# EAGLE design sumo_motor_5 (EAGLE 6.3)
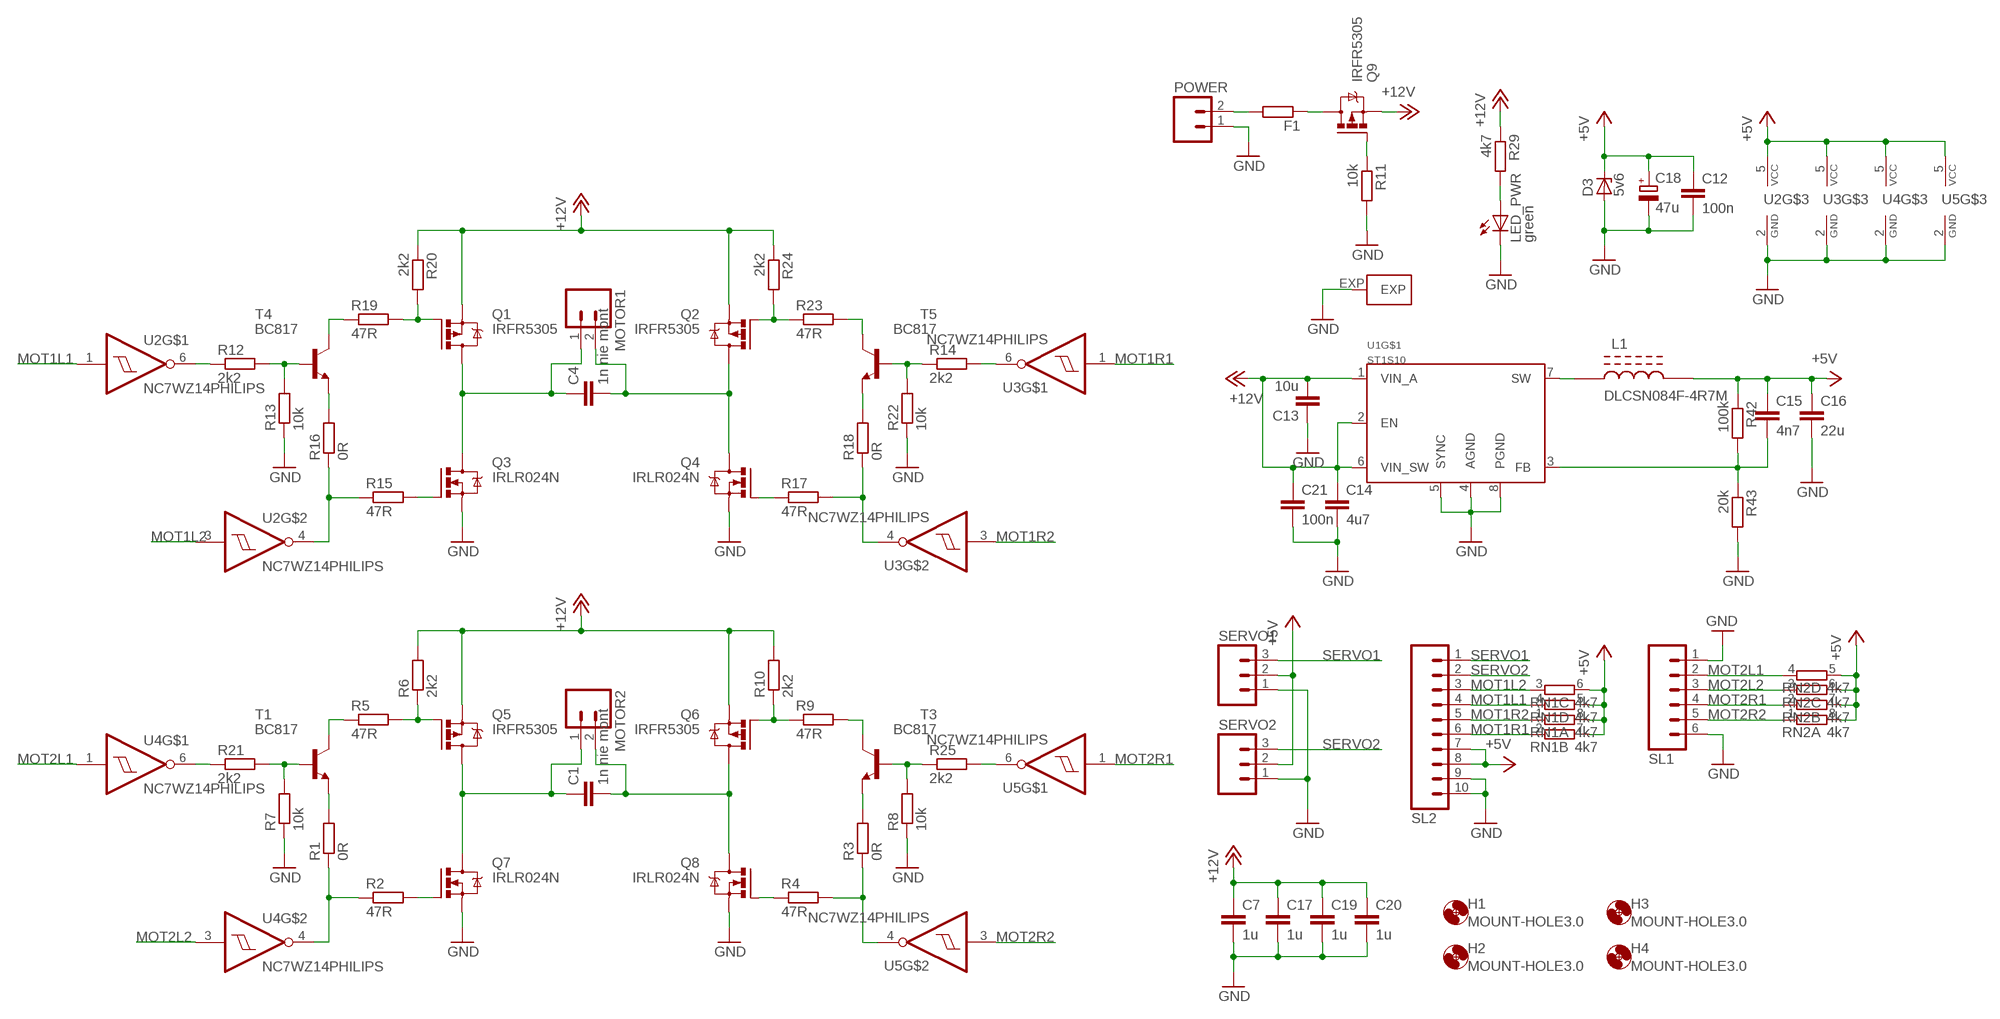
[diagram p0: schematic, sheet 1]

## Parts
C1  1n nie mont  C-EU025-025X050  [C025-025X050]
C4  1n nie mont  C-EU025-025X050  [C025-025X050]
C7  1u  C-EUC0805  [C0805]
C12  100n  C-EUC0805  [C0805]
C13  10u  C-EUC1206K  [C1206K]
C14  4u7  C-EUC0805  [C0805]
C15  4n7  C-EUC0805  [C0805]
C16  22u  C-EUC0805  [C0805]
C17  1u  C-EUC0805  [C0805]
C18  47u  CPOL-EUSMCB  [SMC_B]
C19  1u  C-EUC0805  [C0805]
C20  1u  C-EUC0805  [C0805]
C21  100n  C-EUC0805  [C0805]
D3  5v6  ZENER-DIODESMB  [SMB]
F1  R-EU_VMTA55  [VMTA55]
H1  MOUNT-HOLE3.0  [3,0]
H2  MOUNT-HOLE3.0  [3,0]
H3  MOUNT-HOLE3.0  [3,0]
H4  MOUNT-HOLE3.0  [3,0]
L1  DLCSN084F-4R7M  DLCSN084F  [CSN084F]
LED_PWR  green  LEDSML0805  [SML0805]
MOTOR1  M02  [02P]
MOTOR2  M02  [02P]
POWER  M02  [02P]
Q1  IRFR5305  [D-PAK_TO252AA]
Q2  IRFR5305  [D-PAK_TO252AA]
Q3  IRLR024N  [D-PAK_TO252AA]
Q4  IRLR024N  [D-PAK_TO252AA]
Q5  IRFR5305  [D-PAK_TO252AA]
Q6  IRFR5305  [D-PAK_TO252AA]
Q7  IRLR024N  [D-PAK_TO252AA]
Q8  IRLR024N  [D-PAK_TO252AA]
Q9  IRFR5305  [D-PAK_TO252AA]
R1  0R  R-EU_R0603  [R0603]
R2  47R  R-EU_R0603  [R0603]
R3  0R  R-EU_R0603  [R0603]
R4  47R  R-EU_R0603  [R0603]
R5  47R  R-EU_R0603  [R0603]
R6  2k2  R-EU_R0603  [R0603]
R7  10k  R-EU_R0603  [R0603]
R8  10k  R-EU_R0603  [R0603]
R9  47R  R-EU_R0603  [R0603]
R10  2k2  R-EU_R0603  [R0603]
R11  10k  R-EU_R0603  [R0603]
R12  2k2  R-EU_R0603  [R0603]
R13  10k  R-EU_R0603  [R0603]
R14  2k2  R-EU_R0603  [R0603]
R15  47R  R-EU_R0603  [R0603]
R16  0R  R-EU_R0603  [R0603]
R17  47R  R-EU_R0603  [R0603]
R18  0R  R-EU_R0603  [R0603]
R19  47R  R-EU_R0603  [R0603]
R20  2k2  R-EU_R0603  [R0603]
R21  2k2  R-EU_R0603  [R0603]
R22  10k  R-EU_R0603  [R0603]
R23  47R  R-EU_R0603  [R0603]
R24  2k2  R-EU_R0603  [R0603]
R25  2k2  R-EU_R0603  [R0603]
R29  4k7  R-EU_R0603  [R0603]
R42  100k  R-EU_R0603  [R0603]
R43  20k  R-EU_R0603  [R0603]
RN1  4k7  CAT16XXXJ4CAT16  [CAT16XXX]
RN2  4k7  CAT16XXXJ4CAT16  [CAT16XXX]
SERVO1  M03  [03P]
SERVO2  M03  [03P]
SL1  M06  [06P]
SL2  M10  [10P]
T1  BC817  BC817-16-NPN-SOT23-BEC  [SOT23-BEC]
T3  BC817  BC817-16-NPN-SOT23-BEC  [SOT23-BEC]
T4  BC817  BC817-16-NPN-SOT23-BEC  [SOT23-BEC]
T5  BC817  BC817-16-NPN-SOT23-BEC  [SOT23-BEC]
U1  ST1S10  [HSOP8]
U2  NC7WZ14PHILIPS  [SOT363_PHILIPS]
U3  NC7WZ14PHILIPS  [SOT363_PHILIPS]
U4  NC7WZ14PHILIPS  [SOT363_PHILIPS]
U5  NC7WZ14PHILIPS  [SOT363_PHILIPS]

## Nets
+5V: C12.1 C15.1 C16.1 C18.+ D3.C L1.2 R42.1 RN1.5 RN1.6 RN1.7 RN1.8 RN2.5 RN2.6 RN2.7 RN2.8 SERVO1.2 SERVO2.2 SL2.7 SL2.8 U2.5(VCC) U3.5(VCC) U4.5(VCC) U5.5(VCC)
+12V: C7.1 C13.2 C14.1 C17.1 C19.1 C20.1 C21.1 Q1.3(S) Q2.3(S) Q5.3(S) Q6.3(S) Q9.3(S) R6.2 R10.2 R20.1 R24.1 R29.1 U1.1(VIN_A) U1.2(EN) U1.6(VIN_SW)
GND: C7.2 C12.2 C13.1 C14.2 C16.2 C17.2 C18.- C19.2 C20.2 C21.2 D3.A LED_PWR.C POWER.1 Q3.3(S) Q4.3(S) Q7.3(S) Q8.3(S) R7.1 R8.1 R11.2 R13.1 R22.1 R43.2 SERVO1.1 SERVO2.1 SL1.1 SL1.6 SL2.9 SL2.10 U1.4(AGND) U1.5(SYNC) U1.8(PGND) U1.EXP U2.2(GND) U3.2(GND) U4.2(GND) U5.2(GND)
MOT1L1: RN1.4 SL2.4 U2.1(I)
MOT1L2: RN1.3 SL2.3 U2.3(I)
MOT1R1: RN1.2 SL2.6 U3.1(I)
MOT1R2: RN1.1 SL2.5 U3.3(I)
MOT2L1: RN2.4 SL1.2 U4.1(I)
MOT2L2: RN2.3 SL1.3 U4.3(I)
MOT2R1: RN2.2 SL1.4 U5.1(I)
MOT2R2: RN2.1 SL1.5 U5.3(I)
N$3: R5.1 T1.C
N$4: C1.1 MOTOR2.1 Q5.4(D) Q7.4(D)
N$5: C1.2 MOTOR2.2 Q6.4(D) Q8.4(D)
N$6: R19.1 T4.C
N$7: R7.2 R21.2 T1.B
N$8: Q5.1(G) R5.2 R6.1
N$9: Q6.1(G) R9.1 R10.1
N$10: R21.1 U4.6(O)
N$11: R1.2 T1.E
N$12: R1.1 R2.1 U4.4(O)
N$13: Q3.1(G) R15.2
N$14: R16.2 T4.E
N$15: Q7.1(G) R2.2
N$16: C4.1 MOTOR1.1 Q1.4(D) Q3.4(D)
N$17: C4.2 MOTOR1.2 Q2.4(D) Q4.4(D)
N$18: Q1.1(G) R19.2 R20.2
N$19: Q2.1(G) R23.1 R24.2
N$20: Q4.1(G) R17.1
N$21: R17.2 R18.1 U3.4(O)
N$22: R12.2 R13.2 T4.B
N$23: R12.1 U2.6(O)
N$24: R18.2 T5.E
N$25: R14.2 U3.6(O)
N$26: F1.2 POWER.2
N$27: F1.1 Q9.4(D)
N$28: LED_PWR.A R29.2
N$31: Q8.1(G) R4.1
N$32: R3.1 R4.2 U5.4(O)
N$33: R3.2 T3.E
N$34: R9.2 T3.C
N$35: R8.2 R25.1 T3.B
N$36: R25.2 U5.6(O)
N$41: L1.1 U1.7(SW)
N$43: C15.2 R42.2 R43.1 U1.3(FB)
N$46: Q9.1(G) R11.1
N$47: R23.2 T5.C
N$48: R15.1 R16.1 U2.4(O)
N$51: R14.1 R22.2 T5.B
SERVO1: SERVO1.3 SL2.1
SERVO2: SERVO2.3 SL2.2

## Library data of the parts
C1 C4 C7 C12-C17 C19-C21 = rcl:C-EU: CAPACITOR, European symbol
C18 = rcl:CPOL-EU: POLARIZED CAPACITOR, European symbol
D3 = diode:ZENER-DIODE: Z-Diode
F1 R1-R25 R29 R42 R43 = rcl:R-EU_: RESISTOR, European symbol
H1-H4 = holes:MOUNT-HOLE: MOUNTING HOLE with drill center marker
L1 = inductors:DLCSN084F
LED_PWR = led:LED: LED OSRAM: - CHIPLED LG R971, LG N971, LY N971, LG Q971, LY Q971, LO R971, LY R971 LH N974, LH R974 LS Q976, LO Q976, LY Q976 LO Q996 - Hyper CHIPLED LW Q18S LB Q993, LB Q99A, LB R99A - SideLED LS A670, LO A670, LY A670, LG A670, LP A670 LB A673, LV A673, LT A673, LW A673 LH A674 LY A675 LS A676, LA A676, LO A676, LY A676, LW A676 LS A679, LY A679, LG A679 - Hyper Micro SIDELED® LS Y876, LA Y876, LO Y876, LY Y876 LT Y87S - SmartLED LW L88C, LW L88S LB L89C, LB L89S, LG L890 LS L89K, LO L89K, LY L89K LS L896, LA L896, LO L896, LY L896 - TOPLED LS T670, LO T670, LY T670, LG T670, LP T670 LSG T670, LSP T670, LSY T670, LOP T670, LYG T670 LG T671, LOG T671, LSG T671 LB T673, LV T673, LT T673, LW T673 LH T674 LS T676, LA T676, LO T676, LY T676, LB T676, LH T676, LSB T676, LW T676 LB T67C, LV T67C, LT T67C, LS T67K, LO T67K, LY T67K, LW E67C LS E67B, LA E67B, LO E67B, LY E67B, LB E67C, LV E67C, LT E67C LW T67C LS T679, LY T679, LG T679 LS T770, LO T770, LY T770, LG T770, LP T770 LB T773, LV T773, LT T773, LW T773 LH T774 LS E675, LA E675, LY E675, LS T675 LS T776, LA T776, LO T776, LY T776, LB T776 LHGB T686 LT T68C, LB T68C - Hyper Mini TOPLED® LB M676 - Mini TOPLED Santana® LG M470 LS M47K, LO M47K, LY M47K Source: http://www.osram.convergy.de LUXEON: - LUMILED® LXK2-PW12-R00, LXK2-PW12-S00, LXK2-PW14-U00, LXK2-PW14-V00 LXK2-PM12-R00, LXK2-PM12-S00, LXK2-PM14-U00 LXK2-PE12-Q00, LXK2-PE12-R00, LXK2-PE12-S00, LXK2-PE14-T00, LXK2-PE14-U00 LXK2-PB12-K00, LXK2-PB12-L00, LXK2-PB12-M00, LXK2-PB14-N00, LXK2-PB14-P00, LXK2-PB14-Q00 LXK2-PR12-L00, LXK2-PR12-M00, LXK2-PR14-Q00, LXK2-PR14-R00 LXK2-PD12-Q00, LXK2-PD12-R00, LXK2-PD12-S00 LXK2-PH12-R00, LXK2-PH12-S00 LXK2-PL12-P00, LXK2-PL12-Q00, LXK2-PL12-R00 Source: www.luxeon.com KINGBRIGHT: KA-3528ASYC Source: www.kingbright.com
MOTOR1 MOTOR2 POWER = con-amp-quick:M02: AMP QUICK CONNECTOR; OC_FARNELL: unknown; OC_NEWARK: unknown
Q1 Q2 Q5 Q6 Q9 = irf:IRF?5305: HEXFET Power MOSFET Source: http://www.irf.com/product-info/datasheets/data/irfr5305pbf.pdf
Q3 Q4 Q7 Q8 = irf:IRLR024N
RN1 RN2 = ff:CAT16XXXJ4
SERVO1 SERVO2 = con-amp-quick:M03: AMP QUICK CONNECTOR; OC_FARNELL: unknown; OC_NEWARK: unknown
SL1 = con-amp-quick:M06: AMP QUICK CONNECTOR; OC_FARNELL: unknown; OC_NEWARK: unknown
SL2 = con-amp-quick:M10: AMP QUICK CONNECTOR; OC_FARNELL: unknown; OC_NEWARK: unknown
T1 T3-T5 = transistor:*-NPN-: NPN Transistror BF959 corrected 2008.03.06
U1 = st:ST1S10
U2-U5 = nc7wz:NC7WZ14

## Board
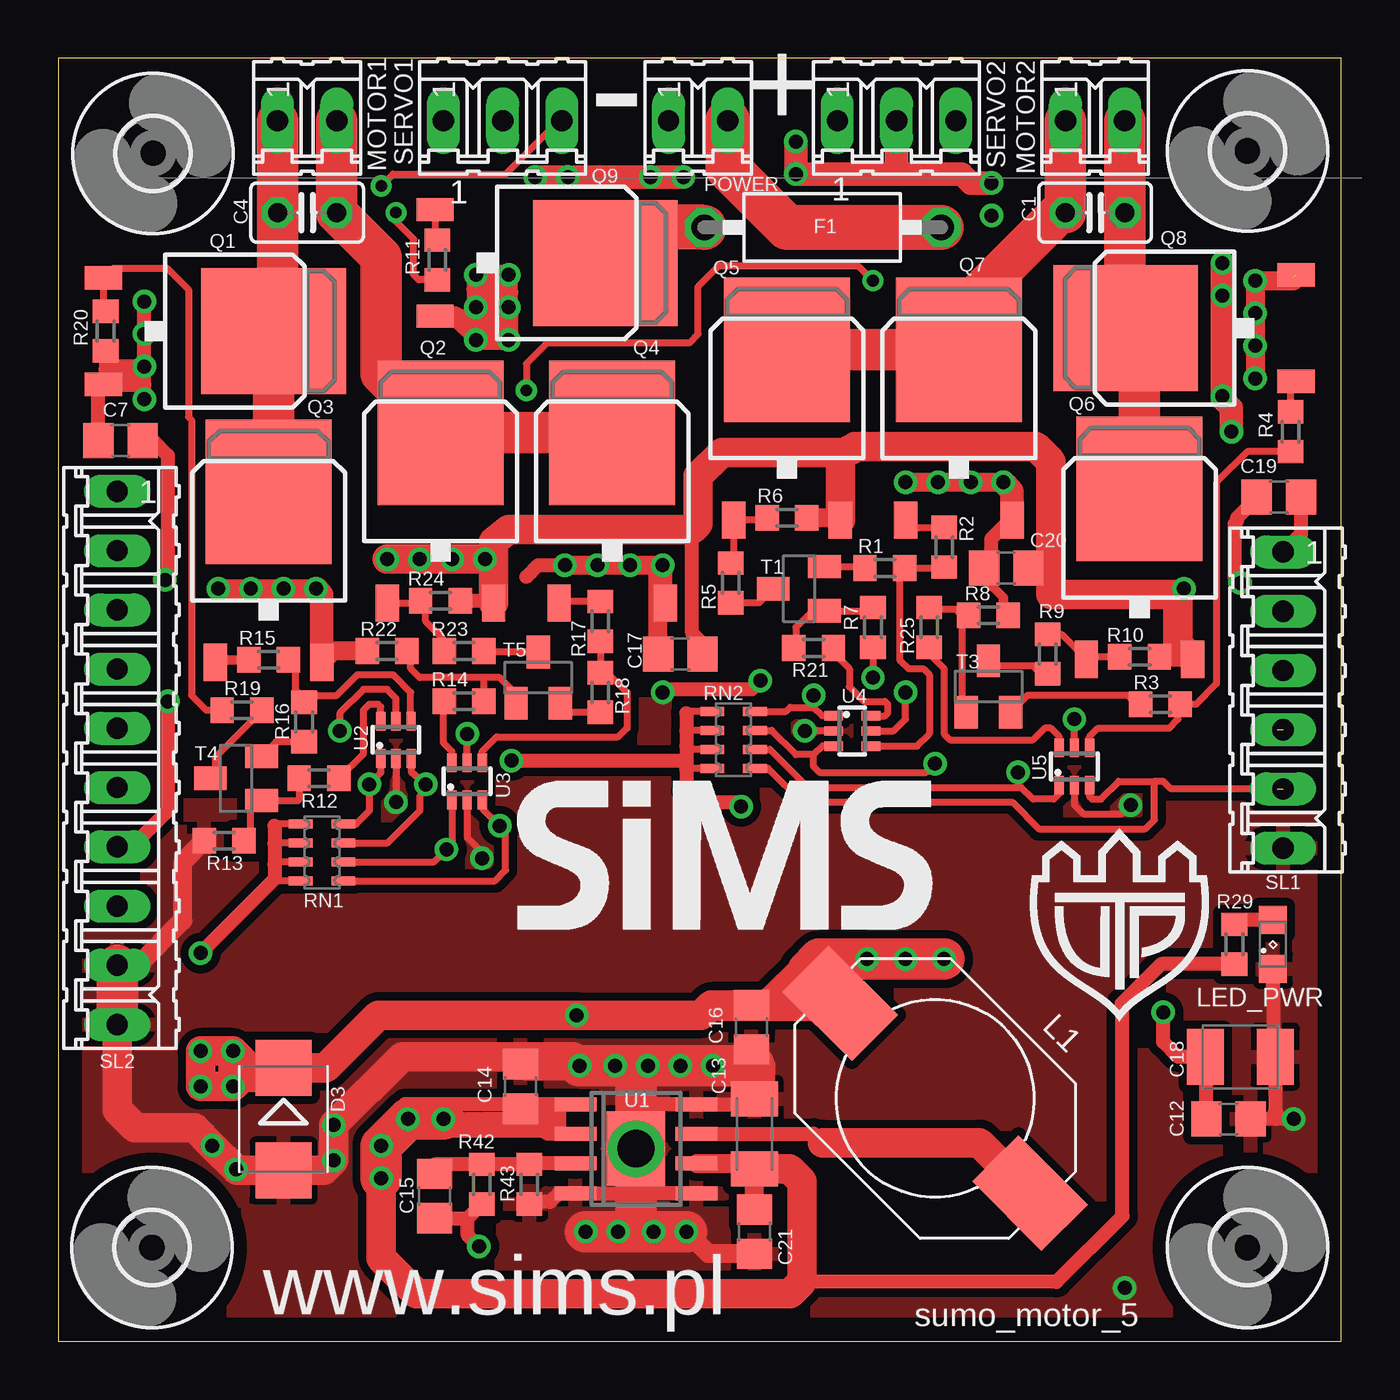
[diagram p1: board, top side]
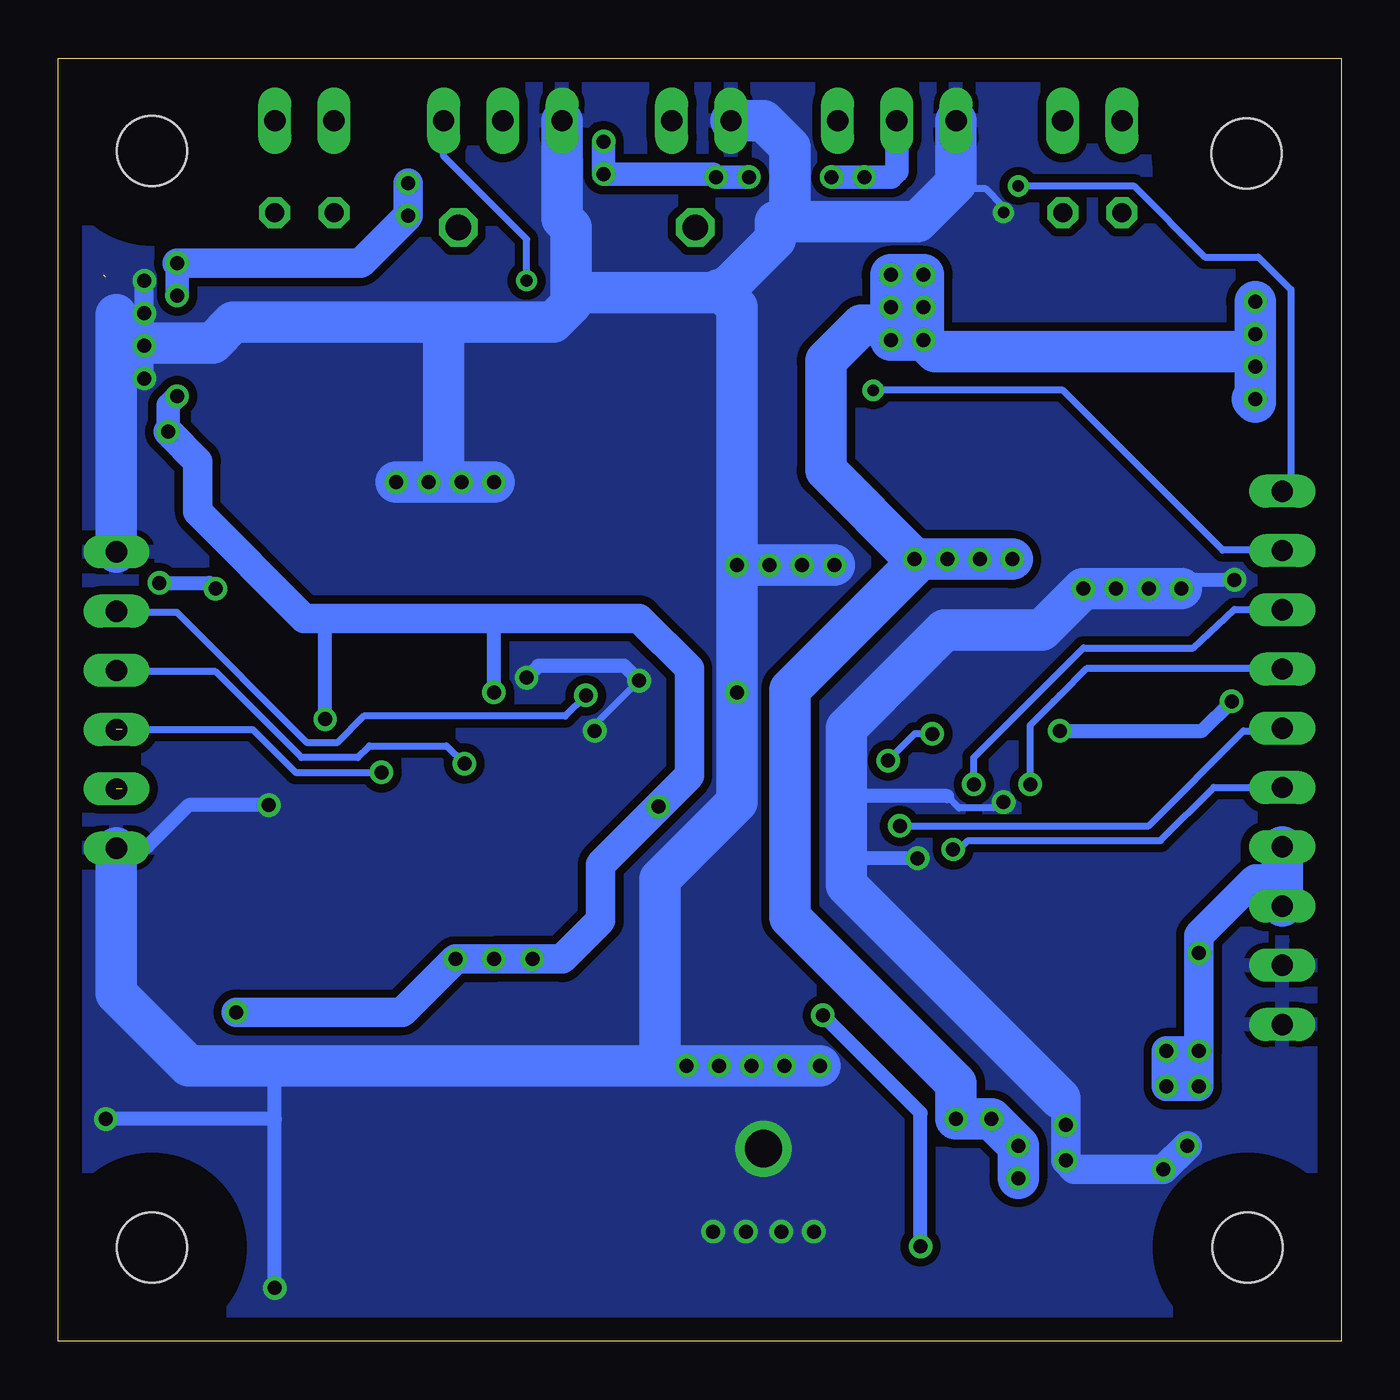
[diagram p2: board, bottom side, seen from below]

Size 55 x 55 mm. Coordinates in mm from the lower left corner, seen from the top.
Outline: 0,0 55,0 55,55 0,55 0,0
Copper layers (1*16): Top 0.035mm / dielectric 1.5mm / Bottom 0.035mm
Design rules "default *": minimum track width 10mil, minimum drill 19mil, track to track 14mil, track to pad 10mil, pad to pad 8mil, via to via 8mil, smd to smd 8mil, copper to edge 40mil, drill to drill 8mil, minimum pad ring 10mil, minimum via ring 8mil, stop-mask expansion 4mil, vias tented up to drill 100mil, thermal gap 10mil

### Footprints (pad centres in the part's own frame; a part is rotated, then mirrored left to right if it is on the bottom)
C025-025X050 = drill 0.813 octagon: 1 -1.27,0; 2 1.27,0
C0805 = smd 1.3 x 1.5: 1 -0.95,0; 2 0.95,0
C1206K = smd 1.5 x 2: 1 -1.5,0; 2 1.5,0
SMC_B = smd 1.6 x 2.4: + -1.5,0; - 1.5,0
SMB = smd 2.4 x 2.4: A 2.2,0; C -2.2,0
VMTA55 = drill 1.1 octagon: 1 -5.08,0; 2 5.08,0
3,0 = hole 3: 0,0
CSN084F = smd 4.2 x 2.79: 1 -5.75,0; 2 5.75,0
SML0805 = smd 1.2 x 1.2: A 1.05,0; C -1.05,0
02P = drill 0.914 long: 1 -1.27,0; 2 1.27,0
D-PAK_TO252AA = smd 1 x 1.6: 1 -2.28,-4.8; 3 2.28,-4.8 | smd 5.4 x 6.2: 4 0,2.5
R0603 = smd 1 x 1.1: 1 -0.85,0; 2 0.85,0
CAT16XXX = smd 0.381 x 1.016: 1 -1.219,-0.914; 2 -0.406,-0.914; 3 0.406,-0.914; 4 1.219,-0.914; 5 1.219,0.914; 6 0.406,0.914; 7 -0.406,0.914; 8 -1.219,0.914
03P = drill 0.914 long: 1 -2.54,0; 2 0,0; 3 2.54,0
06P = drill 0.914 long: 1 -6.35,0; 2 -3.81,0; 3 -1.27,0; 4 1.27,0; 5 3.81,0; 6 6.35,0
10P = drill 0.914 long: 1 -11.43,0; 2 -8.89,0; 3 -6.35,0; 4 -3.81,0; 5 -1.27,0; 6 1.27,0; 7 3.81,0; 8 6.35,0; 9 8.89,0; 10 11.43,0
SOT23-BEC = smd 1 x 1.4: B -0.95,-1.1; C 0,1.1; E 0.95,-1.1
HSOP8 = smd 0.6 x 1.8: 1 -1.905,-2.6; 2 -0.635,-2.6; 3 0.635,-2.6; 4 1.905,-2.6; 5 1.905,2.6; 6 0.635,2.6; 7 -0.635,2.6; 8 -1.905,2.6 | smd 3.2 x 2.51: EXP 0,0
SOT363_PHILIPS = smd 0.4 x 0.8: 1 -0.65,-0.8; 2 0,-0.8; 3 0.65,-0.8; 4 0.65,0.8; 5 0,0.8; 6 -0.65,0.8

### Placement (x,y rotation side)
C1  44.45,48.39 0 top
C4  10.67,48.39 0 top
C7  2.67,38.61 0 top
C12  50.16,9.53 0 top
C13  29.84,8.89 270 top
C14  19.81,10.92 90 top
C15  16.13,6.22 90 top
C16  29.72,13.46 270 top
C17  26.67,29.46 180 top
C18  50.67,12.19 0 top
C19  52.32,36.2 0 top
C20  40.64,33.15 180 top
C21  29.84,4.7 270 top
D3  9.65,9.53 270 top
F1  32.77,47.75 0 top
H1  4.01,4.01 0 top
H2  4.06,50.93 0 top
H3  50.98,51.03 0 top
H4  50.98,4.01 0 top
L1  37.59,10.41 135 top
LED_PWR  52.07,17.02 90 top
MOTOR1  10.67,52.32 0 top
MOTOR2  44.45,52.32 0 top
POWER  27.43,52.32 0 top
Q1  6.73,43.31 270 top
Q2  16.38,36.45 0 top
Q3  9.02,33.91 0 top
Q4  23.75,36.45 0 top
Q5  31.24,40.01 0 top
Q6  46.35,34.04 0 top
Q7  38.61,40.01 0 top
Q8  48.26,43.43 90 top
Q9  20.95,46.23 270 top
R1  35.43,33.15 180 top
R2  37.97,34.04 90 top
R3  47.24,27.3 180 top
R4  52.83,38.99 270 top
R5  28.83,32.51 90 top
R6  31.24,35.31 0 top
R7  34.92,30.61 90 top
R8  39.88,31.11 180 top
R9  42.42,29.46 270 top
R10  46.35,29.34 0 top
R11  16.26,46.35 270 top
R12  11.18,24.13 180 top
R13  7.11,21.46 0 top
R14  17.4,27.43 180 top
R15  9.02,29.21 180 top
R16  10.54,26.54 270 top
R17  23.24,30.86 270 top
R18  23.24,27.81 270 top
R19  7.87,27.05 180 top
R20  2.03,43.31 90 top
R21  32.38,29.72 180 top
R22  14.1,29.59 0 top
R23  17.4,29.59 0 top
R24  16.38,31.75 180 top
R25  37.34,30.61 270 top
R29  50.42,17.02 90 top
R42  18.16,6.73 90 top
R43  20.19,6.73 270 top
RN1  11.3,20.95 90 top
RN2  28.96,25.78 90 top
SERVO1  19.05,52.32 0 top
SERVO2  35.94,52.32 0 top
SL1  52.51,27.49 270 top
SL2  2.52,25.01 270 top
T1  31.75,32.26 90 top
T3  39.88,28.07 0 top
T4  7.62,24.13 90 top
T5  20.57,28.45 0 top
U1  24.77,8.26 270 top
U2  14.48,25.78 0 top
U3  17.53,24 0 top
U4  34.04,26.16 270 top
U5  43.56,24.64 0 top
U$1  [SIMS_07]  19.68,17.65 0 top
U$2  [UTP_016]  41.66,13.72 0 top

### Tracks (layer width: path | path; a pad name or v marks a point on that pad's centre or on a via)
+5V  (via drill 0.6)
  Top 0.305: U4.5 35.81,26.16 36.32,26.67 v36.32,27.81 | U5.5 v43.56,26.67 | RN2.5 27,27 26.92,26.92 | U2.5 14.48,27.56 14.1,27.94 13.08,27.94 12.06,26.92 v12.06,26.16 | U3.5 v17.53,26.04 | RN1.5 9.35,22.17 9.27,22.1 | RN1.6 9.3,21.36 9.27,21.34 | RN1.7 9.37,20.55 9.27,20.45 | RN1.8 9.35,19.74 9.27,19.81 | RN2.6 26.95,26.19 26.92,26.16 | RN2.7 27.08,25.38 26.92,25.53 | RN2.8 26.98,24.56 26.92,24.51
  Top 0.406: L1.2 33.47,14.48 33.47,14.54 | 49.22,12.15 49.15,12.15 49.15,12.06
  Top 0.61: 49.22,12 49.15,12.06 | C15.1 17.55,5.27 | 17.55,5.27 R42.1 | v18.03,4.06 17.55,4.54 17.55,5.27 | C12.1 49.22,12.15 C18.+ 48.01,12.19 47.37,12.83 v47.37,14.1 | 26.92,26.92 26.92,26.16 26.92,25.53 26.92,25.02 | 26.92,25.02 26.92,24.51 26.92,23.62 27.43,23.11 29.08,23.11 v29.27,22.92 | v4.7,27.43 4.7,22.73 3.17,21.21 2.54,21.21 SL2.7 | 9.27,22.1 9.27,21.34 9.27,20.45 9.27,19.81 v6.1,16.64 | v19.43,24.89 26.8,24.89 26.92,25.02
  Top 1.016: v49.91,46.23 v49.91,44.83 v49.91,40.51 49.91,40.39 50.29,40.01 v50.29,38.99 | v40.01,49.66 39.12,49.66 38.73,50.04 35.69,50.04 | 35.69,50.04 v31.62,50.04 v31.62,51.44 | SERVO2.2 35.94,50.29 35.69,50.04 | v20.45,49.91 v21.84,49.91 v25.4,49.91 v26.8,49.91
  Top 1.27: v36.32,16.38 v34.67,16.38 | v7.49,10.92 v6.1,10.92 v6.1,12.45 v7.49,12.45 | v7.49,10.92 v7.49,12.45 | L1.2 32.89,15.11 | v7.49,12.45 8.21,11.72 D3.C 11.47,11.72 13.72,13.97 v22.23,13.97 27.56,13.97 27.94,14.35 | v7.49,10.92 7.87,11.3 9.27,11.3 9.53,11.56 9.53,11.68 | L1.2 33.47,14.54 32.13,15.88 32.13,16.13 30.41,14.41 C16.1 28,14.41 27.94,14.35 | 27.94,14.35 33.53,14.35
  Top 1.778: 34.42,16.38 v34.67,16.38 | v34.67,16.38 v37.97,16.38 | v34.67,16.38 32.64,16.38 32.13,15.88
  Bottom 0.305: v17.53,26.04 18.29,26.04 v19.43,24.89
  Bottom 0.61: v22.23,13.97 18.03,9.78 v18.03,4.06 | v36.32,27.81 36.32,30.73 36.58,30.99 | v43.56,26.67 43.56,30.86 43.69,30.99 | v12.06,26.16 5.97,26.16 v4.7,27.43
  Bottom 1.016: v50.29,38.99 50.29,40.13 v49.91,40.51 | v49.91,44.83 v49.91,46.23 | SERVO1.2 19.05,50.16 19.3,49.91 v20.45,49.91 v21.84,49.91 | v25.4,49.91 v26.8,49.91 26.92,50.04 v31.62,50.04 v31.62,51.44
  Bottom 1.27: v50.29,38.99 49.02,37.72 49.02,35.56 44.45,30.99 43.69,30.99 36.58,30.99 30.1,30.99 27.94,28.83 27.94,24.26 v29.27,22.92 31.75,20.45 31.75,18.03 33.4,16.38 v36.32,16.38 v37.97,16.38 40.26,14.1 v47.37,14.1 | 2.54,19.81 3.68,19.81 6.1,17.4 v6.1,16.64 v6.1,12.45 | v6.1,10.92 v7.49,12.45 | v49.91,46.23 42.04,46.23 v40.01,48.26 v40.01,49.66 | v6.1,12.45 v7.49,12.45 | v7.49,12.45 v7.49,10.92 v6.1,10.92 | v6.1,10.92 v6.1,12.45
  Bottom 1.778: SL2.7 SL2.8 2.52,19.8 2.54,19.81
+12V  (via drill 0.6)
  Top 0.61: 22.23,10.16 U1.1 14.86,10.16 14.99,10.03 v14.99,9.53 | U1.6 27.05,7.62 | 33.52,37.2 Q5.3 33.5,35.18 | C20.1 42.55,32.19 42.55,32 | C7.1 1.72,40.81 Q1.3 2.03,41.13 | 2.03,41.66 2.03,41.13 | Q2.3 18.56,31.75 R24.1 17.27,31.79 | C19.1 51.37,36.13 50.55,35.31 50.55,35.18 50.42,35.05 50.42,32.77 v50.67,32.51 | 48.26,29.61 Q6.3 | 27.18,34.8 27.18,30.35 27.43,30.1 27.43,29.65 C17.1 | 18.54,33.27 18.66,33.15 | v48.26,32.26 48.01,32 | v3.68,40.39 3.68,41.02 | 3.68,41.02 v3.68,41.78 | v3.68,41.78 v3.68,44.58 | R20.1 2.03,41.66 | 2.03,41.13 2.03,41.02 3.68,41.02 | v3.68,41.78 2.16,41.78 2.03,41.66 | Q9.3 17.02,43.95 17.53,43.95 v17.91,44.32 | 3.43,41.53 3.56,41.53 3.56,41.4 | 18.54,43.56 18.67,43.56 v19.3,42.93 | 2.29,41.53 3.43,41.53 | 3.43,41.53 v3.68,41.78 | 31.88,2.54 42.8,2.54 45.63,5.37 45.59,5.41 45.59,14.48 47.28,16.17 R29.1 | U1.2 21.46,8.89 | 21.46,8.89 21.34,8.89 | 21.34,8.89 20.95,8.89 20.83,9.02 13.97,9.02 | v16.51,9.53 16.7,9.72 16.7,9.59 16.76,9.53 21.14,9.59 21.46,9.91 21.46,8.89 | C14.1 20.25,9.97 21.34,8.89
  Top 0.813: v17.91,42.93 17.91,43.06 17.02,43.95 | v17.91,42.93 v19.3,42.93 19.3,44.2 | 17.91,45.09 v17.91,44.32 | v17.91,42.93 17.91,44.2 18.03,44.32 19.18,44.32 19.3,44.2 | 19.3,44.96 v19.3,44.32 19.3,44.2 | 19.3,44.96 v19.3,45.72 v17.91,45.72 17.91,45.09 | 17.91,45.09 19.18,45.09 19.3,44.96 | 18.03,43.56 18.54,43.56 19.18,43.56 | U1.6 29.61,7.62 C13.2 C21.1 | R6.2 33.42,35.31 Q5.3 | R10.2 48.53,29.34 Q6.3
  Top 1.27: Q2.3 18.66,33.15 18.66,33.66 | 18.66,33.66 18.66,34.28 19.3,34.8 27.18,34.8 27.43,35.05 27.43,37.08 28.45,38.1 33.53,38.1 33.52,38.09 | Q5.3 33.52,38.09 | 33.52,38.09 33.78,38.09 33.91,38.23 34.04,38.23 34.16,38.35 41.91,38.35 42.55,37.72 42.55,32 48.01,32 48.01,29.86 48.26,29.61 | 18.66,33.66 18.54,33.53 v18.29,33.53 v16.89,33.53 v15.49,33.53 v14.1,33.53 | v13.84,6.99 13.84,3.56 15.37,2.03 31.37,2.03 31.88,2.54 31.88,6.86 31.34,7.39 C13.2
  Top 1.778: v16.51,9.53 v14.99,9.53 v13.84,8.38 v13.84,6.99
  Bottom 0.61: v50.67,32.51 48.51,32.51 v48.26,32.26 | 3.68,42.67 3.68,42.42 v3.68,40.39 | 18.54,13.72 19.05,13.72 19.68,14.35 19.81,14.35
  Bottom 1.778: 3.68,42.42 17.4,42.42 v17.91,42.93 | v17.91,42.93 18.54,43.56 20.57,43.56 22.1,42.04 22.1,37.34 v18.29,33.53 | v3.68,44.58 v3.68,43.18 3.68,42.67 v3.68,40.39 | 3.68,40.26 v3.68,40.39 | v3.68,40.39 3.81,40.39 | v17.91,42.93 v17.91,45.72 v19.3,45.72 v19.3,42.93 v17.91,42.93 | v14.1,33.53 v18.29,33.53 | v18.29,33.53 18.29,33.27 23.62,27.94 23.62,18.16 19.81,14.35 16.51,11.05 v16.51,9.53 v14.99,9.53 v13.84,8.38 v13.84,6.99
GND  (via drill 0.5, 0.6, 1.6)  (1 unrouted)
  Top 0.305: R11.2 15.46,45.51 15.24,45.72 15.24,47.24 14.48,48.01 v14.48,48.39 | SL2.10 | R7.1 v34.92,28.45 | U4.2 v32,26.16 | U5.2 43.56,22.99 43.94,22.61 45.59,22.61 v45.97,22.99 | U2.2 v14.48,23.11 | U3.2 17.53,21.59 18.16,20.95 v18.16,20.7 | Q4.3 26.01,31.65 25.91,31.75 25.91,31.82 25.72,32
  Top 0.406: C20.2 39.69,32.7 40.51,31.88 40.51,31.33 R8.1
  Top 0.61: C16.2 C13.1 30.1,10.16 U1.8 25.53,10.16 24.89,9.53 24.89,8.38 U1.EXP 24.77,7.11 | U1.5 25.53,6.35 24.77,7.11 | 24.77,7.11 24,6.35 U1.4 21.46,6.35 21.08,5.97 20.28,5.97 R43.2 | 52.96,45.47 52.96,45.61 | 20.07,32.77 20.57,33.27 v21.72,33.27 | C7.2 4.06,38.61 4.7,37.97 4.7,32.77 v4.57,32.64 | C19.2 53.27,34.6 SL1.1 | 2.61,15.58 2.52,15.49 | 2.52,9.92 2.54,9.65 2.54,15.24 | C18.- 52.17,9.86 52.2,9.86 52.2,9.53 | C18.- 52.2,12.95 | v52.96,9.53 52.2,9.53 | 52.2,9.53 C12.2 | LED_PWR.C 52.1,12.26 C18.- | C20.2 40.01,33.46 40.01,34.42 40.79,35.2 Q7.3 | v30.1,28.32 29.72,27.94 26.04,27.94 v25.91,27.81
  Top 0.813: v51.31,41.27 v51.31,44.07 v51.31,45.47 52.96,45.47 | v6.86,32.26 v8.26,32.26 v9.65,32.26 v11.05,32.26 | v25.91,33.27 25.91,31.77 | v21.72,33.27 v23.11,33.27 v24.51,33.27 v25.91,33.27 | v36.32,36.83 v37.72,36.83 v39.12,36.83 v40.51,36.83 | C21.2 27.87,3.75 v26.92,4.7 | C17.2 25.72,32 25.72,33.09 v25.91,33.27 | R22.1 11.78,29.59 Q3.3 | SL2.9 3.42,16.12 5.33,18.03 5.33,20.54 R13.1
  Top 1.016: v40.51,36.83 40.89,36.45 Q7.3 | Q3.3 11.3,32.01 v11.05,32.26
  Top 1.27: C14.2 20.13,12.19 | 20.13,12.19 22.1,12.19 v22.35,11.81 20.07,11.81 19.94,11.94 | 20.13,12.19 14.73,12.19 v11.81,9.27 v11.81,7.75 11.39,7.33 D3.A 7.66,7.33 v7.62,7.37 v6.6,8.38 5.84,9.14 3.3,9.14 2.52,9.92 SL2.10
  Top 1.778: v22.61,4.7 v24,4.7 24.77,4.7 | v26.92,4.7 v25.53,4.7 24.77,4.7 | 24.77,4.7 U1.EXP 24.77,11.81 | 2.52,15.13 SL2.10 | v22.35,11.81 v23.88,11.81 24.77,11.81 | 24.77,11.81 v25.27,11.81 v26.67,11.81 v28.07,11.81 29.84,11.81 29.84,10.54 | SL2.9 2.52,15.49 2.52,15.13 | 2.52,15.13 2.54,15.11 2.54,14.61
  Bottom 0.305: v14.48,48.39 14.48,48.64 15.24,49.4 16.26,49.4 16.51,49.66 | v32,26.16 32,26.42 v30.1,28.32 | v14.48,23.11 14.73,22.86 16.38,22.86 16.89,23.37
  Bottom 0.61: v4.57,32.64 6.48,32.64 v6.86,32.26 | 27.05,22.23 27.3,22.23 27.3,21.97 27.37,21.65 | v45.72,2.29 45.72,9.53 | 45.72,9.53 45.72,11.05 45.85,11.18 45.85,11.81 | 52.68,44.01 51.37,44.01 v51.31,44.07 | 45.72,9.53 v52.96,9.53 | v30.1,28.32 30.73,28.96 34.42,28.96 v34.92,28.45 | v45.97,22.99 49.4,22.99 51.18,21.21 52.44,21.21 SL1.6 | 16.89,23.37 20.83,23.37 21.21,23.62 | v18.16,20.7 20.83,20.7 21.21,20.57
  Bottom 0.813: v51.31,41.27 v51.31,42.67 | v51.31,45.47 v51.31,44.07 51.31,42.8 | 52.51,44.01 52.68,44.01 | 26.67,45.09 26.67,44.96
  Bottom 1.27: 12.06,10.41 11.81,10.16 v11.81,7.75 11.43,7.37 v7.62,7.37 v6.6,8.38
  Bottom 1.778: SERVO2.1 33.4,48.13 33.02,47.75 33.02,44.96 | POWER.1 24.77,52.32 23.62,51.18 23.62,48.13 23.75,48.01 | SL1.1 52.51,44.01 | 33.02,44.96 33.02,44.45 33.78,43.69 38.48,43.69 | 33.02,44.96 26.67,44.96 26.54,44.96 24.26,47.24 24.26,48.01 23.75,48.01 | SERVO1.1 16.51,49.66 18.16,48.01 23.75,48.01 | v6.86,32.26 v11.05,32.26 12.83,30.48 17.02,30.48 21.21,26.29 21.21,23.62 21.21,20.57 21.21,19.56 12.06,10.41 | v21.72,33.27 v25.91,33.27 | v36.32,36.83 38.35,36.83 | 38.35,36.83 v40.51,36.83 | 38.48,43.69 38.48,36.96 38.35,36.83 | v25.91,33.27 25.91,44.32 26.67,45.09 | 38.48,43.69 47.5,43.69 48.39,42.8 51.31,42.8 | 51.31,42.8 51.56,42.8 | v51.31,42.67 51.31,42.8 | v25.91,33.27 v25.91,27.81 25.91,23.11 27.37,21.65 29.21,19.81 29.21,11.81 | v22.35,11.81 v23.88,11.81 v25.27,11.81 v26.67,11.81 v28.07,11.81 29.21,11.81 | SL1.6 52.51,14.92 49.4,11.81 45.85,11.81 29.21,11.81
  other vias: 24.77,8.26
  pour Bottom: 0.51,0.51 54.48,0.51 54.48,54.48 0.51,54.48
  pour Top: 0.51,0.51 54.48,0.51 54.48,27.3 0.51,27.3
MOT1L1  (via drill 0.6)
  Top 0.305: U2.1 13.83,24.37 v13.34,23.88 13.34,22.73 12.78,22.17 RN1.4
  Bottom 0.305: v13.34,23.88 13.34,26.42 12.32,27.43 12.06,27.69 10.92,28.83 2.54,28.83 SL2.4
MOT1L2  (via drill 0.6)
  Top 0.305: U2.3 15.13,24.4 v15.75,23.88 15.75,23.62 15.49,23.37 15.49,22.73 14.12,21.36 RN1.3
  Bottom 0.305: SL2.3 2.54,31.37 4.57,31.37 6.35,29.72 11.05,29.72 15.75,25.02 v15.75,23.88
MOT1R1  (via drill 0.6)
  Top 0.305: U3.1 16.88,21.32 v16.64,21.08 16.1,20.55 RN1.2
  Bottom 0.305: SL2.6 2.54,23.75 5.46,23.75 7.75,21.46 16,21.46 16.38,21.08 v16.64,21.08
MOT1R2  (via drill 0.6)
  Top 0.305: U3.3 18.18,22.84 v18.92,22.1 19.18,21.84 19.18,20.19 18.72,19.74 RN1.1
  Bottom 0.305: SL2.5 2.64,26.16 4.19,26.16 8.26,22.1 v18.92,22.1
MOT2L1  (via drill 0.6)
  Top 0.305: RN2.4 31.19,27 31.37,27.18 32.38,27.18 | U4.1 32.75,26.81 32.38,27.18 | 32.38,27.18 v32.38,27.69
  Bottom 0.305: SL1.2 52.46,31.24 49.91,31.24 44.32,25.65 43.05,25.65 41.91,26.8 33.27,26.8 v32.38,27.69
MOT2L2  (via drill 0.6)
  Top 0.305: 33.13,25.51 U4.3 32.78,25.51 32.77,25.53 32.38,25.15 | RN2.3 30.58,26.19 31.62,25.15 32.38,25.15 | 32.38,25.15 32.38,24.64 32.64,24.38 37.21,24.38 v37.59,24.77
  Bottom 0.305: SL1.3 52.46,28.7 48.26,28.7 44.58,25.02 42.16,25.02 41.66,25.53 38.35,25.53 v37.59,24.77
MOT2R1  (via drill 0.6)  (1 unrouted)
  Top 0.305: RN2.2 30.5,25.38 32.13,23.75 41.15,23.75 | 41.15,23.75 41.27,23.75 41.78,23.24 42.67,23.24 42.91,23.48 U5.1 | v41.15,24.38 41.15,23.75
  Bottom 0.305: 52.25,26.22 46.66,26.22 44.83,24.38 v41.15,24.38
MOT2R2  (1 unrouted)
  Top 0.305: RN2.1 30.43,24.56 31.88,23.11 40.89,23.11 42.04,21.97 46.61,21.97 46.99,22.35 46.99,24 | U5.3 44.21,23.35 44.32,23.24 44.7,23.24 45.47,24 46.99,24 | 52.25,23.68 47.7,23.68 47.37,24 46.99,24
N$3
  Top 0.305: R5.1 30.05,31.66 T1.C
N$4
  Top 1.778: MOTOR2.1 C1.1 42.93,48.39 39.5,44.96 39.5,43.39 Q7.4 Q5.4
N$5
  Top 1.778: MOTOR2.2 C1.2 45.72,43.47 Q8.4 46.35,42.84 Q6.4
N$6
  Top 0.305: R19.1 8.72,27.01 6.73,25.02 6.73,24.34 T4.C
N$7
  Top 0.305: R7.2 34.39,31.31 T1.B 32.32,31.31 31.62,30.61 31.62,29.81 R21.2
N$8
  Top 0.305: R6.1 30.29,35.2 Q5.1 28.96,35.2 28.96,33.49 R5.2
N$9
  Top 0.305: R10.1 44.18,29.34 Q6.1 43,30.31 R9.1
N$10
  Top 0.305: R21.1 33.23,29.5 33.91,28.83 33.91,28.07 34.54,27.43 35.43,27.43 35.56,27.3 35.56,26.92 35.45,26.81 U4.6
N$11
  Top 0.305: T1.E 34.52,33.21 R1.2
N$12
  Top 0.305: R2.1 37.93,33.15 R1.1 36.28,32.85 36.07,32.64 36.07,29.21 36.45,28.83 37.08,28.83 37.34,28.57 37.34,26.04 36.81,25.51 U4.4
N$13
  Top 0.406: R15.2 6.74,29.21 Q3.1
N$14
  Top 0.305: R16.2 9.33,25.69 T4.E
N$15
  Top 0.305: Q7.1 36.65,34.89 R2.2
N$16
  Top 1.778: MOTOR1.1 C4.1 9.4,42.97 9.23,42.8 | Q3.4 9.23,36.41 9.23,42.8 | 9.23,42.8 Q1.4
N$17
  Top 1.778: MOTOR1.2 C4.2 13.84,46.48 13.84,41.49 Q2.4 Q4.4
N$18
  Top 0.305: R20.2 1.93,44.26 Q1.1 2.32,45.97 4.7,45.97 5.59,45.09 5.59,39.62 5.71,39.5 5.71,27.69 6.35,27.05 R19.2
N$19
  Top 0.305: Q2.1 15.53,31.65 R24.2 15.75,31.54 15.75,30.86 16.55,30.06 R23.1
N$20
  Top 0.305: R17.1 21.53,31.71 Q4.1
N$21
  Top 0.305: R17.2 R18.1 23.53,28.66 24.38,27.81 24.38,26.29 24,25.91 18.8,25.91 18.18,25.29 U3.4
N$22
  Top 0.305: R12.2 10.33,23.24 10.27,23.18 T4.B 8.57,23.18 8.26,22.86 8.26,21.76 R13.2
N$23
  Top 0.305: R12.1 13.08,25.18 13.08,27.05 13.34,27.3 13.72,27.3 13.83,27.19 U2.6
N$24
  Top 0.305: R18.2 21.91,26.96 T5.E
N$25
  Top 0.305: U3.6 16.88,25.29 16.51,25.65 16.51,27.34 R14.2
N$26
  Top 1.93: POWER.2 28.7,50.29 31.24,47.75 F1.2
N$27
  Top 1.93: F1.1 24.64,47.75 23.45,46.57 Q9.4
N$28
  Top 0.61: LED_PWR.A 50.62,18.07 R29.2
N$31
  Top 0.305: R4.1 52.83,40.93 Q8.1
N$32
  Top 0.305: R4.2 50.97,38.14 49.66,36.83 49.66,28.19 48.77,27.3 R3.1 48.01,27.22 48.01,26.67 47.62,26.29 44.58,26.29 44.21,25.92 U5.4
N$33
  Top 0.305: R3.2 46.23,27.3 45.85,27.69 41.55,27.69 T3.E
N$34
  Top 0.305: R9.2 42.12,28.61 41.78,28.96 40.09,28.96 T3.C
N$35
  Top 0.305: R25.1 37.43,31.37 38.48,31.37 38.73,31.11 R8.2 38.73,30.82 38.73,27.16 T3.B
N$36
  Top 0.305: R25.2 37.34,29.46 37.97,28.83 37.97,26.04 38.23,25.78 41.78,25.78 42.29,26.29 42.55,26.29 42.91,25.92 U5.6
N$41
  Top 0.61: U1.7 32.38,8.89 32.77,8.51
  Top 1.27: 32.77,8.51 39.5,8.51 L1.1
N$43
  Top 0.61: U1.3 20.23,7.62 R43.1 R42.2 16.13,7.58 C15.2
N$46
  Top 0.305: Q9.1 16.16,47.18 R11.1
N$47
  Top 0.305: T5.C 18.29,29.55 R23.2
N$48
  Top 0.305: R15.1 10.16,28.92 10.16,27.94 10.54,27.56 R16.1 10.83,27.69 11.94,27.69 12.83,28.57 14.35,28.57 15.11,27.81 15.11,26.6 U2.4
N$51
  Top 0.305: T5.B 19.62,27.75 18.92,28.45 18.29,28.45 | 18.29,28.45 15.49,28.45 15.11,28.83 15.11,29.43 R22.2 | R14.1 18.25,28.41 18.29,28.45
SERVO1  (via drill 0.5)
  Top 0.305: v13.84,49.53 14.35,50.04 19.18,50.04 21.46,52.32 SERVO1.3
  Bottom 0.305: v13.84,49.53 8.89,49.53 5.84,46.48 3.56,46.48 2.16,45.09 2.16,36.8 SL2.1
SERVO2  (via drill 0.5)
  Top 0.305: v34.92,45.47 34.29,46.1 28.32,46.1 27.43,45.21 27.43,43.18 27.05,42.8 20.95,42.8 20.07,41.91 v20.07,40.77
  Bottom 0.305: v34.92,45.47 34.92,47.24 38.48,50.8 SERVO2.3 | SL2.2 2.54,33.91 5.08,33.91 11.94,40.77 v20.07,40.77

### Text on the board
tPlace: + | - | 1 | 1 | www.sims.pl | sumo_motor_5